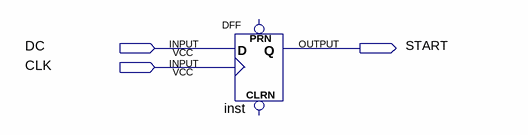
[diagram p0: schematic sheet]
// Quartus schematic DCfM.bdf as structural Verilog: 1 symbols, 3 pins
module DCfM (
  input  DC,
  input  CLK,
  output START
);

  DFF inst (.CLK(CLK), .D(DC), .Q(START));  // open: CLRN, PRN
endmodule
